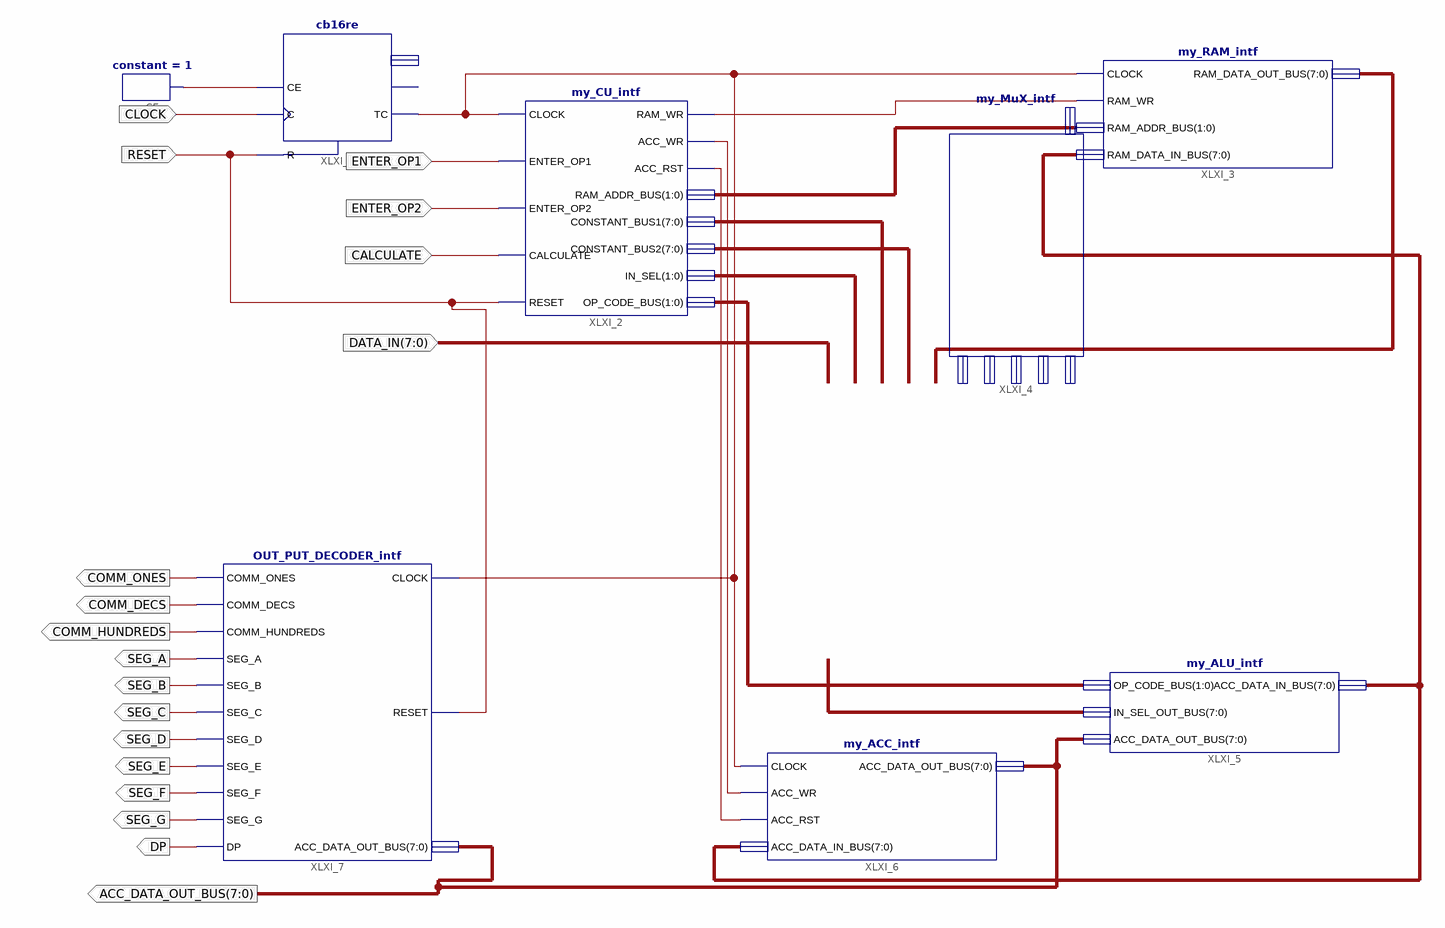
[diagram p0: schematic sheet 1]
// Xilinx ISE schematic top_level_11.sch (spartan3a) as structural Verilog: 8 symbols, 18 ports
module top_level_11 (
  input  ENTER_OP1,
  input  ENTER_OP2,
  input  CALCULATE,
  input  CLOCK,
  input  RESET,
  input  [7:0] DATA_IN,
  output COMM_ONES,
  output COMM_DECS,
  output COMM_HUNDREDS,
  output SEG_A,
  output SEG_B,
  output SEG_C,
  output SEG_D,
  output SEG_E,
  output SEG_F,
  output SEG_G,
  output DP,
  output [7:0] ACC_DATA_OUT_BUS
);

  wire TC, XLXN_4, XLXN_12, XLXN_17, XLXN_18;
  wire [1:0] XLXN_11, XLXN_13, XLXN_21;
  wire [7:0] RAM_DATA_OUT_BUS, XLXN_9, XLXN_10, XLXN_15, XLXN_31;

  cb16re XLXI_1 (.C(CLOCK), .CE(XLXN_4), .R(RESET), .TC(TC));  // open: CEO, Q
  my_CU_intf XLXI_2 (
    .CLOCK(TC), .ENTER_OP1(ENTER_OP1), .ENTER_OP2(ENTER_OP2), .CALCULATE(CALCULATE), .RESET(RESET),
    .RAM_WR(XLXN_12), .ACC_WR(XLXN_17), .ACC_RST(XLXN_18), .RAM_ADDR_BUS(XLXN_13), .CONSTANT_BUS1(XLXN_9),
    .CONSTANT_BUS2(XLXN_10), .IN_SEL(XLXN_11), .OP_CODE_BUS(XLXN_21));
  my_RAM_intf XLXI_3 (
    .CLOCK(TC), .RAM_WR(XLXN_12), .RAM_ADDR_BUS(XLXN_13), .RAM_DATA_IN_BUS(XLXN_31),
    .RAM_DATA_OUT_BUS(RAM_DATA_OUT_BUS));
  my_MuX_intf XLXI_4 (
    .DATA_IN(DATA_IN), .IN_SEL(XLXN_11), .CONSTANT_BUS1(XLXN_9), .CONSTANT_BUS2(XLXN_10),
    .RAM_DATA_OUT_BUS(RAM_DATA_OUT_BUS), .IN_SEL_OUT_BUS(XLXN_15));
  my_ALU_intf XLXI_5 (
    .OP_CODE_BUS(XLXN_21), .IN_SEL_OUT_BUS(XLXN_15), .ACC_DATA_OUT_BUS(ACC_DATA_OUT_BUS),
    .ACC_DATA_IN_BUS(XLXN_31));
  constant #(.CValue("1")) CE (.O(XLXN_4));
  my_ACC_intf XLXI_6 (
    .CLOCK(TC), .ACC_WR(XLXN_17), .ACC_RST(XLXN_18), .ACC_DATA_IN_BUS(XLXN_31),
    .ACC_DATA_OUT_BUS(ACC_DATA_OUT_BUS));
  OUT_PUT_DECODER_intf XLXI_7 (
    .CLOCK(TC), .RESET(RESET), .ACC_DATA_OUT_BUS(ACC_DATA_OUT_BUS), .COMM_ONES(COMM_ONES),
    .COMM_DECS(COMM_DECS), .COMM_HUNDREDS(COMM_HUNDREDS), .SEG_A(SEG_A), .SEG_B(SEG_B), .SEG_C(SEG_C),
    .SEG_D(SEG_D), .SEG_E(SEG_E), .SEG_F(SEG_F), .SEG_G(SEG_G), .DP(DP));
endmodule
